# EAGLE schematic CD_full_schematic (EAGLE 7.6.0)

## Sheet 1 of 2
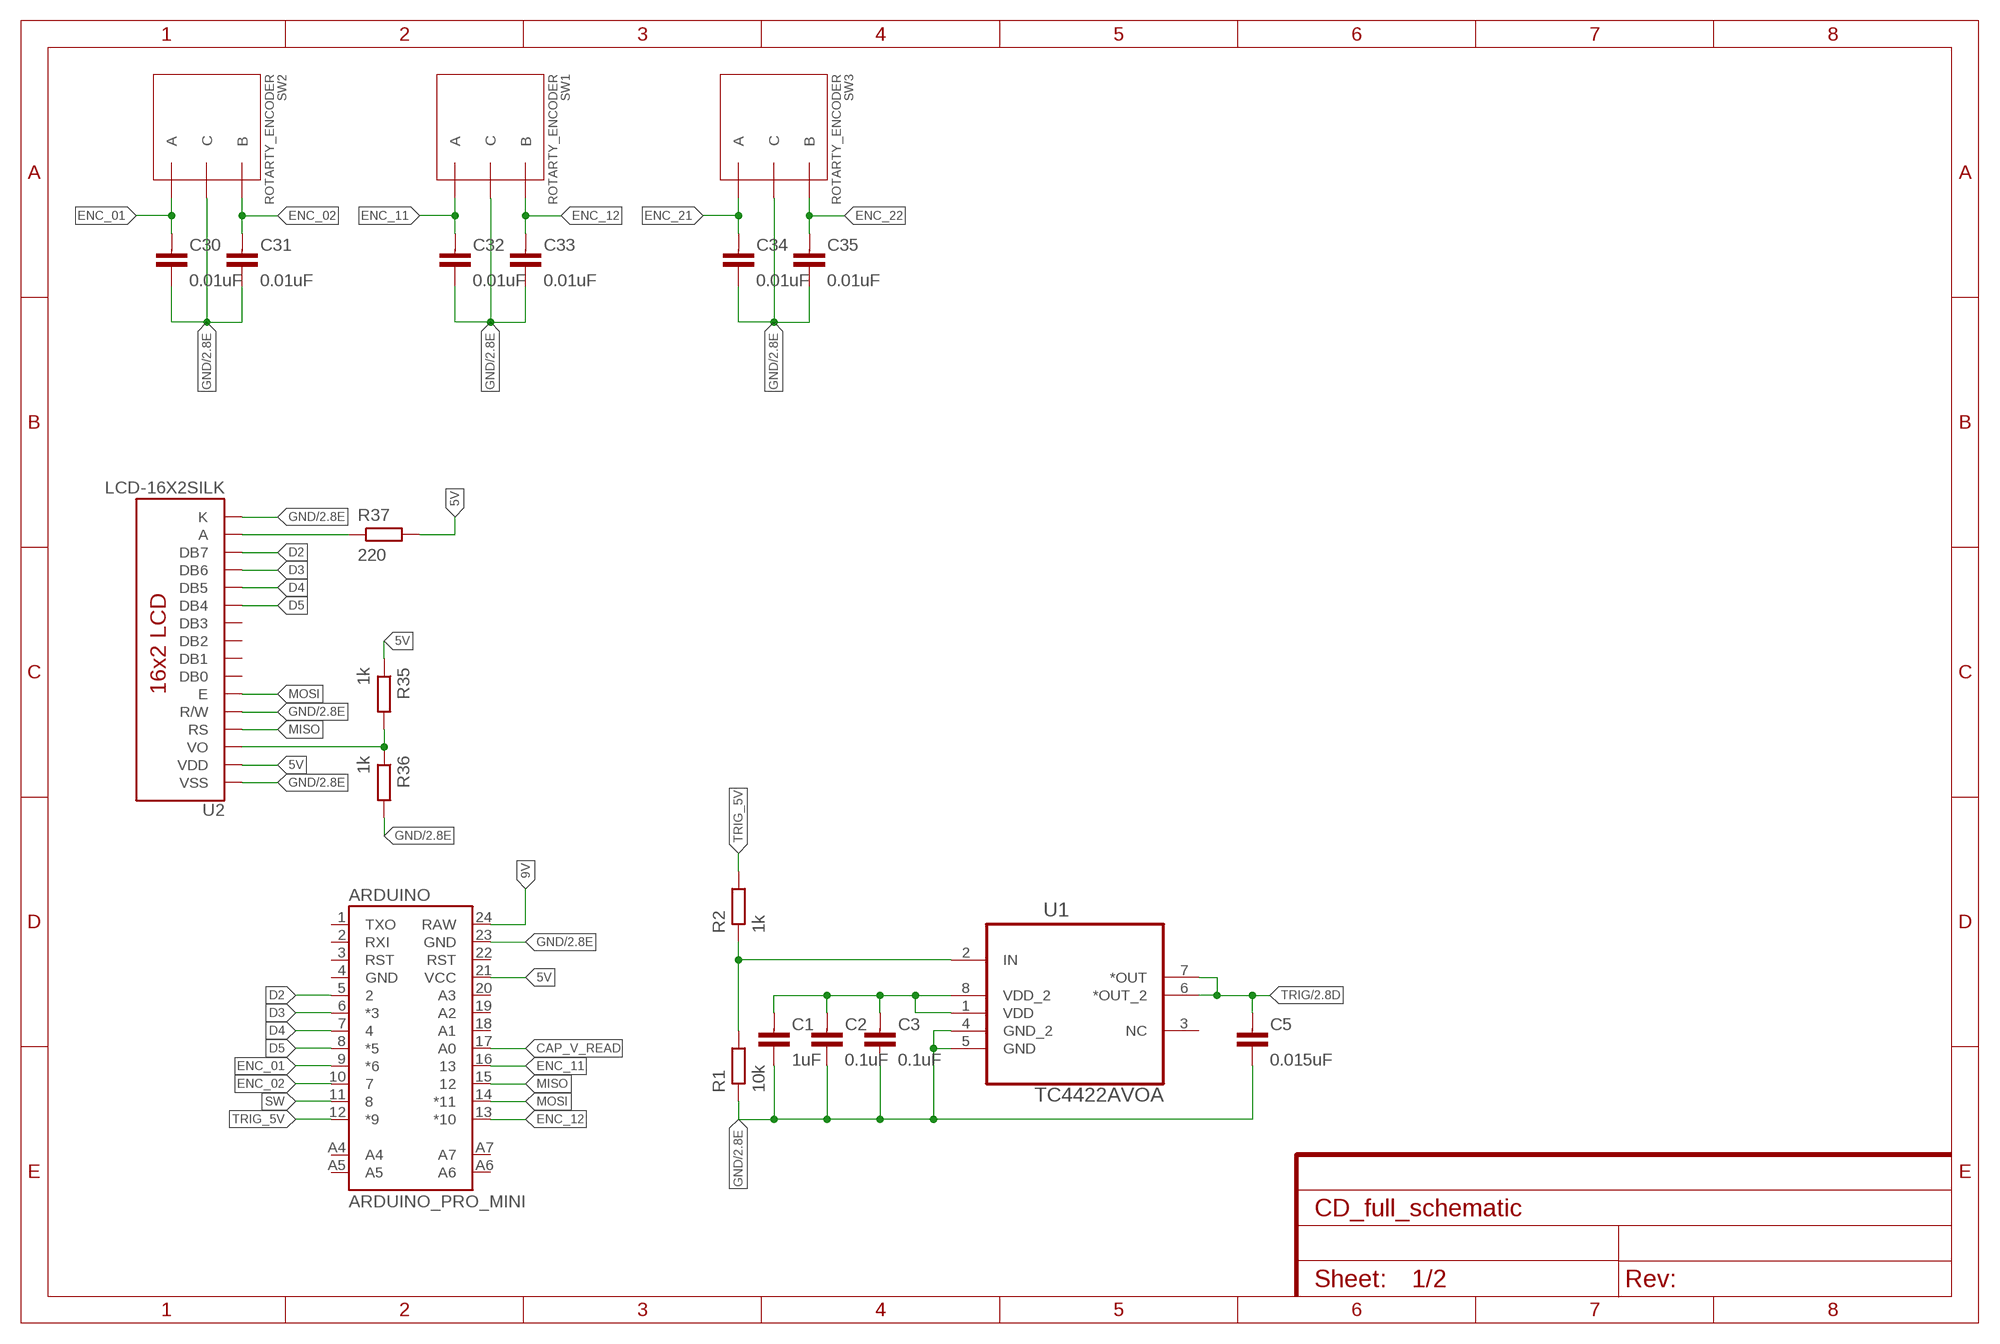
[diagram p0: schematic, sheet 1]

### Parts
ARDUINO  ARDUINO_PRO_MINI  [ARDUINO_PRO_MINI]
C1  1uF  CAPACITOR0805-N  [C0805-N]
C2  0.1uF  CAPACITOR0603-N  [C0603-N]
C3  0.1uF  CAPACITOR0603-N  [C0603-N]
C5  0.015uF  CAPACITOR0603-N  [C0603-N]
C30  0.01uF  CAPACITOR0603-N  [C0603-N]
C31  0.01uF  CAPACITOR0603-N  [C0603-N]
C32  0.01uF  CAPACITOR0603-N  [C0603-N]
C33  0.01uF  CAPACITOR0603-N  [C0603-N]
C34  0.01uF  CAPACITOR0603-N  [C0603-N]
C35  0.01uF  CAPACITOR0603-N  [C0603-N]
R1  10k  RESISTOR0603-N  [R0603-N]
R2  1k  RESISTOR0603-N  [R0603-N]
R35  1k  RESISTOR0603-N  [R0603-N]
R36  1k  RESISTOR0603-N  [R0603-N]
R37  220  RESISTOR0603-N  [R0603-N]
SW1  ROTARTY_ENCODER  [ROTARY_ENC_PLAIN]
SW2  ROTARTY_ENCODER  [ROTARY_ENC_PLAIN]
SW3  ROTARTY_ENCODER  [ROTARY_ENC_PLAIN]
U1  TC4422AVOA  [SOIC127P600X175-8N]
U2  LCD-16X2SILK  [LCD-16X2]

### Nets
5V: ARDUINO.21(VCC) R35.1 R37.2 U2.2(VDD)
9V: ARDUINO.24(RAW)
CAP_V_READ: ARDUINO.17(A0)
D2: ARDUINO.5 U2.14(DB7)
D3: ARDUINO.6(*3) U2.13(DB6)
D4: ARDUINO.7 U2.12(DB5)
D5: ARDUINO.8(*5) U2.11(DB4)
ENC_01: ARDUINO.9(*6) C30.1 SW2.A
ENC_02: ARDUINO.10 C31.1 SW2.B
ENC_11: ARDUINO.16 C32.1 SW1.A
ENC_12: ARDUINO.13(*10) C33.1 SW1.B
ENC_21: C34.1 SW3.A
ENC_22: C35.1 SW3.B
GND: ARDUINO.23(GND) C1.2 C2.2 C3.2 C5.2 C30.2 C31.2 C32.2 C33.2 C34.2 C35.2 R1.1 R36.2 SW1.C SW2.C SW3.C U1.4(GND_2) U1.5(GND) U2.1(VSS) U2.5(R/W) U2.16(K) ; also sheet 2
MISO: ARDUINO.15 U2.4(RS)
MOSI: ARDUINO.14(*11) U2.6(E)
N$2: C1.1 C2.1 C3.1 U1.1(VDD) U1.8(VDD_2)
N$3: R1.2 R2.1 U1.2(IN)
N$17: R37.1 U2.15(A)
N$28: R35.2 R36.1 U2.3(VO)
SW: ARDUINO.11
TRIG: C5.1 U1.6(*OUT_2) U1.7(*OUT) ; also sheet 2
TRIG_5V: ARDUINO.12(*9) R2.2
Unconnected: ARDUINO.1(TXO) ARDUINO.2(RXI) ARDUINO.3(RST) ARDUINO.4(GND) ARDUINO.18(A1) ARDUINO.19(A2) ARDUINO.20(A3) ARDUINO.22(RST) ARDUINO.A4 ARDUINO.A5 ARDUINO.A6 ARDUINO.A7 U1.3(NC) U2.7(DB0) U2.8(DB1) U2.9(DB2) U2.10(DB3)

## Sheet 2 of 2
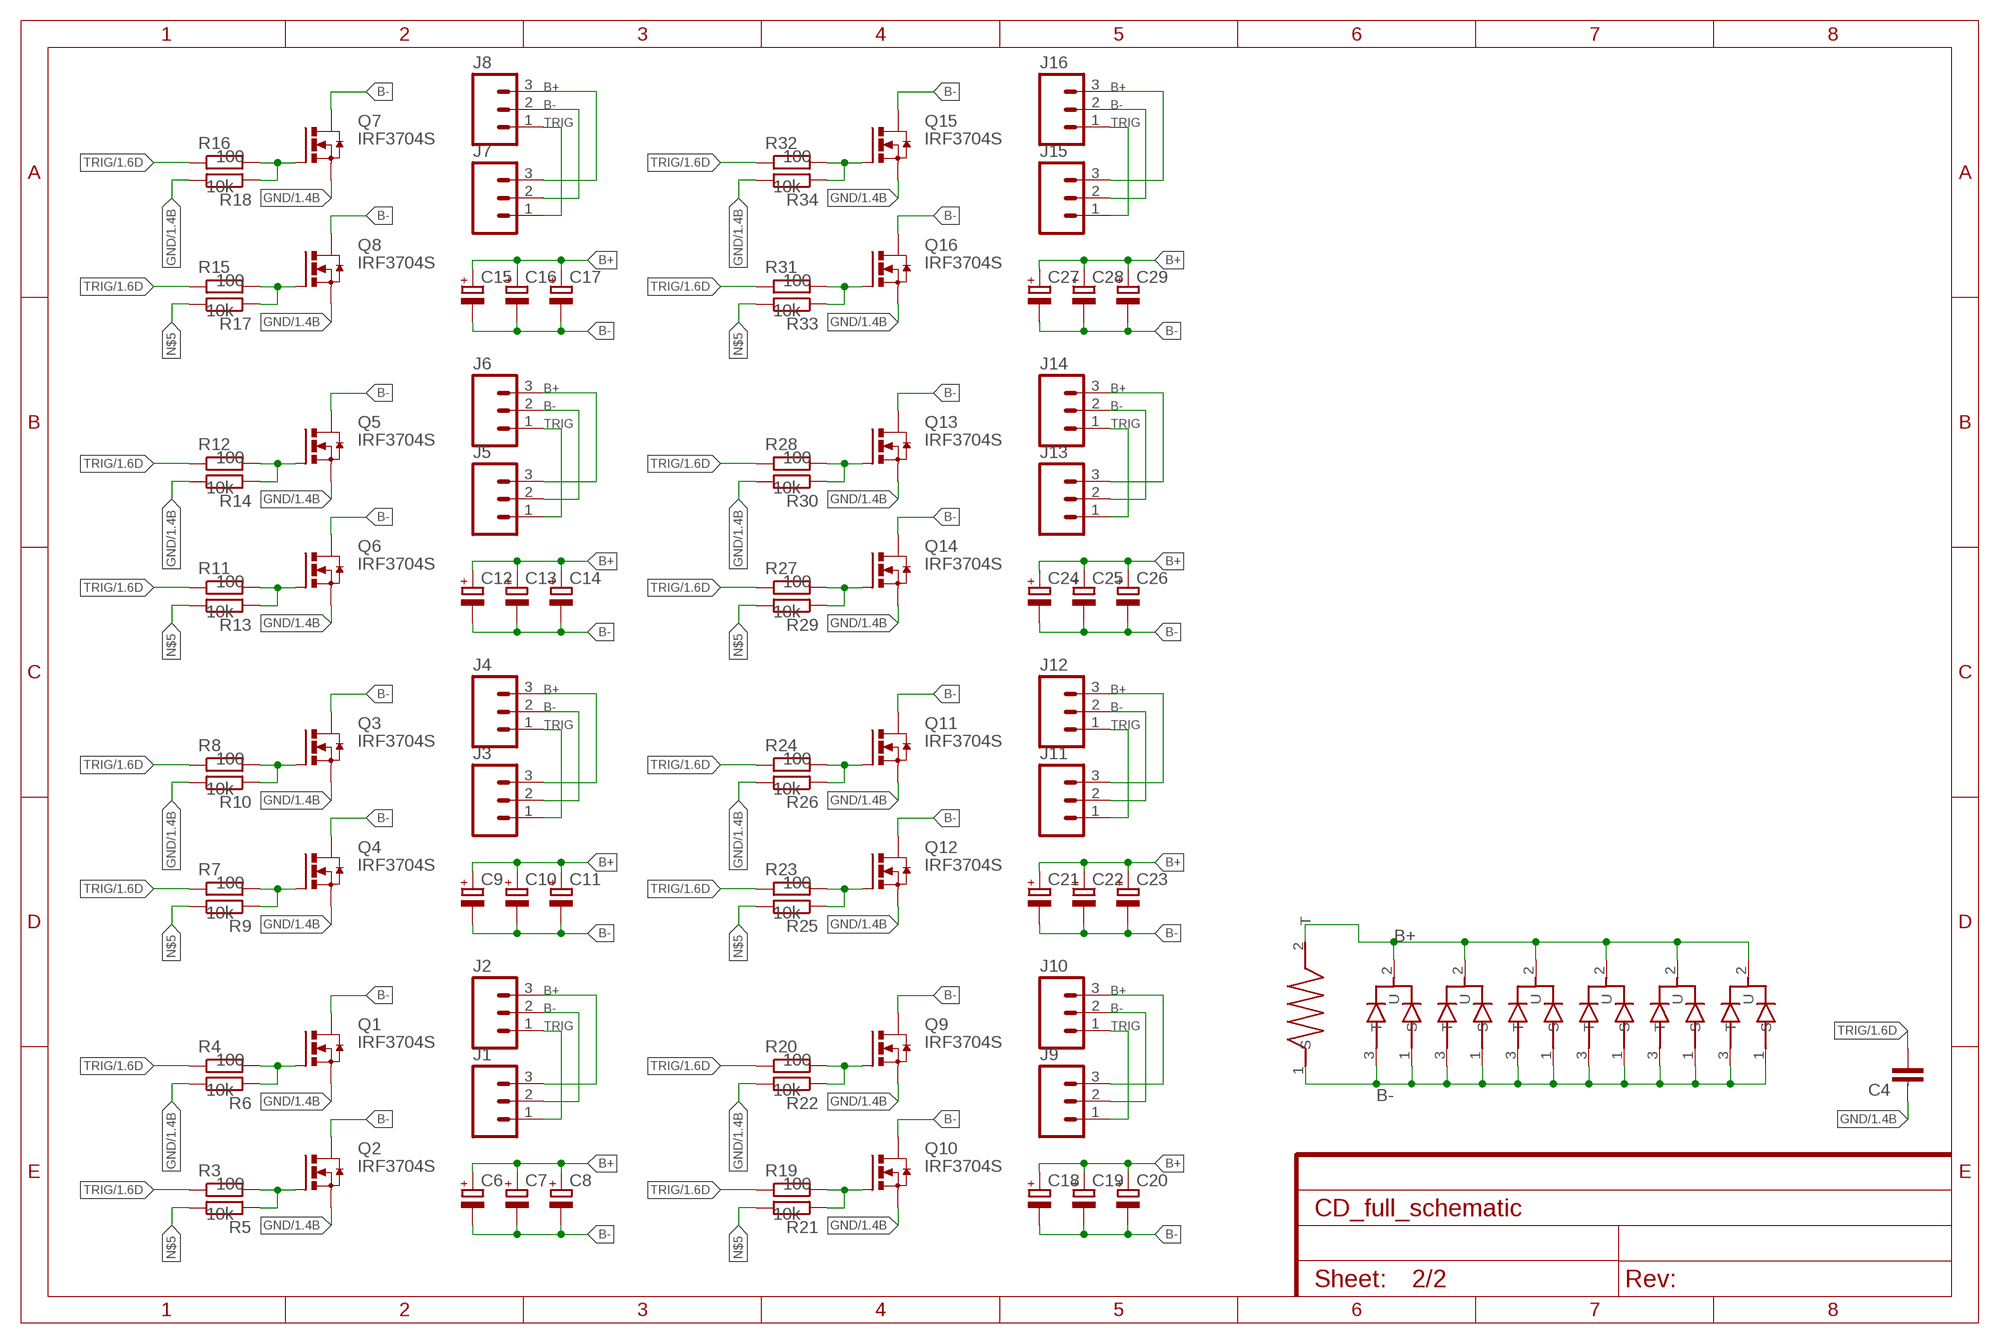
[diagram p1: schematic, sheet 2]

### Parts
C4  CAPACITOR0603-N  [C0603-N]
C6  CPOL-EUE10-35  [EB35D]
C7  CPOL-EUE10-35  [EB35D]
C8  CPOL-EUE10-35  [EB35D]
C9  CPOL-EUE10-35  [EB35D]
C10  CPOL-EUE10-35  [EB35D]
C11  CPOL-EUE10-35  [EB35D]
C12  CPOL-EUE10-35  [EB35D]
C13  CPOL-EUE10-35  [EB35D]
C14  CPOL-EUE10-35  [EB35D]
C15  CPOL-EUE10-35  [EB35D]
C16  CPOL-EUE10-35  [EB35D]
C17  CPOL-EUE10-35  [EB35D]
C18  CPOL-EUE10-35  [EB35D]
C19  CPOL-EUE10-35  [EB35D]
C20  CPOL-EUE10-35  [EB35D]
C21  CPOL-EUE10-35  [EB35D]
C22  CPOL-EUE10-35  [EB35D]
C23  CPOL-EUE10-35  [EB35D]
C24  CPOL-EUE10-35  [EB35D]
C25  CPOL-EUE10-35  [EB35D]
C26  CPOL-EUE10-35  [EB35D]
C27  CPOL-EUE10-35  [EB35D]
C28  CPOL-EUE10-35  [EB35D]
C29  CPOL-EUE10-35  [EB35D]
J1  M03PTH  [1X03]
J2  M03PTH  [1X03]
J3  M03PTH  [1X03]
J4  M03PTH  [1X03]
J5  M03PTH  [1X03]
J6  M03PTH  [1X03]
J7  M03PTH  [1X03]
J8  M03PTH  [1X03]
J9  M03PTH  [1X03]
J10  M03PTH  [1X03]
J11  M03PTH  [1X03]
J12  M03PTH  [1X03]
J13  M03PTH  [1X03]
J14  M03PTH  [1X03]
J15  M03PTH  [1X03]
J16  M03PTH  [1X03]
Q1  IRF3704S  [D2PACK]
Q2  IRF3704S  [D2PACK]
Q3  IRF3704S  [D2PACK]
Q4  IRF3704S  [D2PACK]
Q5  IRF3704S  [D2PACK]
Q6  IRF3704S  [D2PACK]
Q7  IRF3704S  [D2PACK]
Q8  IRF3704S  [D2PACK]
Q9  IRF3704S  [D2PACK]
Q10  IRF3704S  [D2PACK]
Q11  IRF3704S  [D2PACK]
Q12  IRF3704S  [D2PACK]
Q13  IRF3704S  [D2PACK]
Q14  IRF3704S  [D2PACK]
Q15  IRF3704S  [D2PACK]
Q16  IRF3704S  [D2PACK]
R3  100  RESISTOR0603-N  [R0603-N]
R4  100  RESISTOR0603-N  [R0603-N]
R5  10k  RESISTOR0603-N  [R0603-N]
R6  10k  RESISTOR0603-N  [R0603-N]
R7  100  RESISTOR0603-N  [R0603-N]
R8  100  RESISTOR0603-N  [R0603-N]
R9  10k  RESISTOR0603-N  [R0603-N]
R10  10k  RESISTOR0603-N  [R0603-N]
R11  100  RESISTOR0603-N  [R0603-N]
R12  100  RESISTOR0603-N  [R0603-N]
R13  10k  RESISTOR0603-N  [R0603-N]
R14  10k  RESISTOR0603-N  [R0603-N]
R15  100  RESISTOR0603-N  [R0603-N]
R16  100  RESISTOR0603-N  [R0603-N]
R17  10k  RESISTOR0603-N  [R0603-N]
R18  10k  RESISTOR0603-N  [R0603-N]
R19  100  RESISTOR0603-N  [R0603-N]
R20  100  RESISTOR0603-N  [R0603-N]
R21  10k  RESISTOR0603-N  [R0603-N]
R22  10k  RESISTOR0603-N  [R0603-N]
R23  100  RESISTOR0603-N  [R0603-N]
R24  100  RESISTOR0603-N  [R0603-N]
R25  10k  RESISTOR0603-N  [R0603-N]
R26  10k  RESISTOR0603-N  [R0603-N]
R27  100  RESISTOR0603-N  [R0603-N]
R28  100  RESISTOR0603-N  [R0603-N]
R29  10k  RESISTOR0603-N  [R0603-N]
R30  10k  RESISTOR0603-N  [R0603-N]
R31  100  RESISTOR0603-N  [R0603-N]
R32  100  RESISTOR0603-N  [R0603-N]
R33  10k  RESISTOR0603-N  [R0603-N]
R34  10k  RESISTOR0603-N  [R0603-N]
U$1  STTH6002CW  [TO-247]
U$2  STTH6002CW  [TO-247]
U$3  STTH6002CW  [TO-247]
U$4  STTH6002CW  [TO-247]
U$5  STTH6002CW  [TO-247]
U$6  STTH6002CW  [TO-247]
U$7  RESISTOR_5W_1INCH  [RESISTOR_1INCH_5W]

### Nets
B+: C6.+ C7.+ C8.+ C9.+ C10.+ C11.+ C12.+ C13.+ C14.+ C15.+ C16.+ C17.+ C18.+ C19.+ C20.+ C21.+ C22.+ C23.+ C24.+ C25.+ C26.+ C27.+ C28.+ C29.+ J1.3 J2.3 J3.3 J4.3 J5.3 J6.3 J7.3 J8.3 J9.3 J10.3 J11.3 J12.3 J13.3 J14.3 J15.3 J16.3 U$1.2(U) U$2.2(U) U$3.2(U) U$4.2(U) U$5.2(U) U$6.2(U) U$7.2(T)
B-: C6.- C7.- C8.- C9.- C10.- C11.- C12.- C13.- C14.- C15.- C16.- C17.- C18.- C19.- C20.- C21.- C22.- C23.- C24.- C25.- C26.- C27.- C28.- C29.- J1.2 J2.2 J3.2 J4.2 J5.2 J6.2 J7.2 J8.2 J9.2 J10.2 J11.2 J12.2 J13.2 J14.2 J15.2 J16.2 Q1.2(D) Q2.2(D) Q3.2(D) Q4.2(D) Q5.2(D) Q6.2(D) Q7.2(D) Q8.2(D) Q9.2(D) Q10.2(D) Q11.2(D) Q12.2(D) Q13.2(D) Q14.2(D) Q15.2(D) Q16.2(D) U$1.1(S) U$1.3(T) U$2.1(S) U$2.3(T) U$3.1(S) U$3.3(T) U$4.1(S) U$4.3(T) U$5.1(S) U$5.3(T) U$6.1(S) U$6.3(T) U$7.1(S)
GND: C4.1 Q1.1(G) Q1.3(S) Q2.3(S) Q3.1(G) Q3.3(S) Q4.3(S) Q5.1(G) Q5.3(S) Q6.3(S) Q7.1(G) Q7.3(S) Q8.3(S) Q9.1(G) Q9.3(S) Q10.3(S) Q11.1(G) Q11.3(S) Q12.3(S) Q13.1(G) Q13.3(S) Q14.3(S) Q15.1(G) Q15.3(S) Q16.3(S) R4.2 R6.1 R6.2 R8.2 R10.1 R10.2 R12.2 R14.1 R14.2 R16.2 R18.1 R18.2 R20.2 R22.1 R22.2 R24.2 R26.1 R26.2 R28.2 R30.1 R30.2 R32.2 R34.1 R34.2 ; also sheet 1
N$1: Q4.1(G) R7.2 R9.1
N$4: Q2.1(G) R3.2 R5.1
N$5: R5.2 R9.2 R13.2 R17.2 R21.2 R25.2 R29.2 R33.2
N$6: Q6.1(G) R11.2 R13.1
N$7: Q8.1(G) R15.2 R17.1
N$8: Q10.1(G) R19.2 R21.1
N$9: Q12.1(G) R23.2 R25.1
N$10: Q14.1(G) R27.2 R29.1
N$11: Q16.1(G) R31.2 R33.1
TRIG: C4.2 J1.1 J2.1 J3.1 J4.1 J5.1 J6.1 J7.1 J8.1 J9.1 J10.1 J11.1 J12.1 J13.1 J14.1 J15.1 J16.1 R3.1 R4.1 R7.1 R8.1 R11.1 R12.1 R15.1 R16.1 R19.1 R20.1 R23.1 R24.1 R27.1 R28.1 R31.1 R32.1 ; also sheet 1

## Library data of the parts
ARDUINO = SparkFun-Boards:ARDUINO_PRO_MINI
C1-C5 C30-C35 = passives-7351:CAPACITOR
C6-C29 = resistor:CPOL-EU: POLARIZED CAPACITOR, European symbol
J1-J16 = SparkFun-Connectors:M03: Header 3 Standard 3-pin 0.1" header. Use with straight break away headers (SKU : PRT-00116), right angle break away headers (PRT-00553), swiss pins (PRT-00743), machine pins (PRT-00117), and female headers (PRT-00115). Molex polarized connector foot print use with SKU : PRT-08232 with associated crimp pins and housings.
Q1-Q16 = transistor-power:IRF3704: SMPS MOSFET HEXFET® Power MOSFET Source: http://www.irf.com/product-info/datasheets/data/irf3704.pdf
R1-R37 = passives-7351:RESISTOR
SW1-SW3 = _my-parts:ROTARTY_ENCODER: Simple no LED rotary encoder Example: COM-09117
U1 = Microchip_By_element14_Batch_1:TC4422AVOA: DRIVER, MOSFET, SINGL 9A,; MPN: TC4422AVOA; OC_FARNELL: 1332306; OC_NEWARK: 22K2735; PACKAGE: 8 - SOIC; SUPPLIER: Microchip
U2 = SparkFun-Displays:LCD-16X2: Standard text-only 16x2 parallel input LCD
U$1-U$6 = _my-parts:STTH6002CW
U$7 = _my-parts:RESISTOR_5W_1INCH